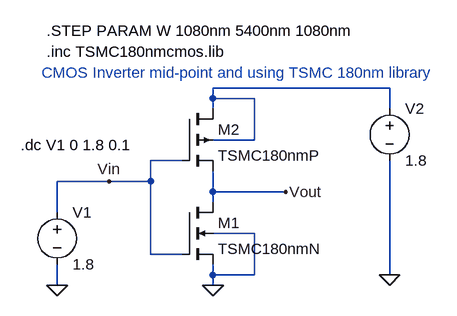
[diagram p0: schematic CMOS_Inv2.asc]
CMOS_Inv2.asc, the LTspice schematic file:
Version 4.1
SHEET 1 880 680
WIRE 480 48 208 48
WIRE 208 64 208 48
WIRE 272 64 208 64
WIRE 208 80 208 64
WIRE 480 80 480 48
WIRE 272 128 272 64
WIRE 272 128 208 128
WIRE 160 160 112 160
WIRE 48 192 -32 192
WIRE 112 192 112 160
WIRE 112 192 48 192
WIRE 208 208 208 176
WIRE 320 208 208 208
WIRE 208 224 208 208
WIRE -32 240 -32 192
WIRE 272 272 208 272
WIRE 112 304 112 192
WIRE 160 304 112 304
WIRE 208 336 208 320
WIRE 272 336 272 272
WIRE 272 336 208 336
WIRE 480 336 480 160
WIRE -32 352 -32 320
WIRE 208 352 208 336
FLAG -32 352 0
FLAG 208 352 0
FLAG 480 336 0
FLAG 320 208 Vout
FLAG 48 192 Vin
SYMBOL voltage 480 64 R0
WINDOW 123 0 0 Left 0
WINDOW 39 0 0 Left 0
SYMATTR InstName V2
SYMATTR Value 1.8
SYMBOL voltage -32 224 R0
WINDOW 123 0 0 Left 0
WINDOW 39 0 0 Left 0
SYMATTR InstName V1
SYMATTR Value 1.8
SYMBOL nmos4 160 224 R0
SYMATTR InstName M1
SYMATTR Value TSMC180nmN
SYMBOL pmos4 160 80 R0
SYMATTR InstName M2
SYMATTR Value TSMC180nmP
SYMATTR Value2 w=W
TEXT -56 24 Left 2 ;CMOS Inverter mid-point and using TSMC 180nm library
TEXT -88 136 Left 2 !.dc V1 0 1.8 0.1
TEXT -48 -8 Left 2 !.inc TSMC180nmcmos.lib
TEXT -48 -40 Left 2 !.STEP PARAM W 1080nm 5400nm 1080nm

The netlist it stands for:
* CMOS_Inv2.asc
V2 N001 0 1.8
V1 Vin 0 1.8
M1 Vout Vin 0 0 TSMC180nmN
M2 N001 Vin Vout N001 TSMC180nmP w=W
.model NMOS NMOS
.model PMOS PMOS
.lib standard.mos
* CMOS Inverter mid-point and using TSMC 180nm library
.dc V1 0 1.8 0.1
.inc TSMC180nmcmos.lib
.STEP PARAM W 1080nm 5400nm 1080nm
.backanno
.end